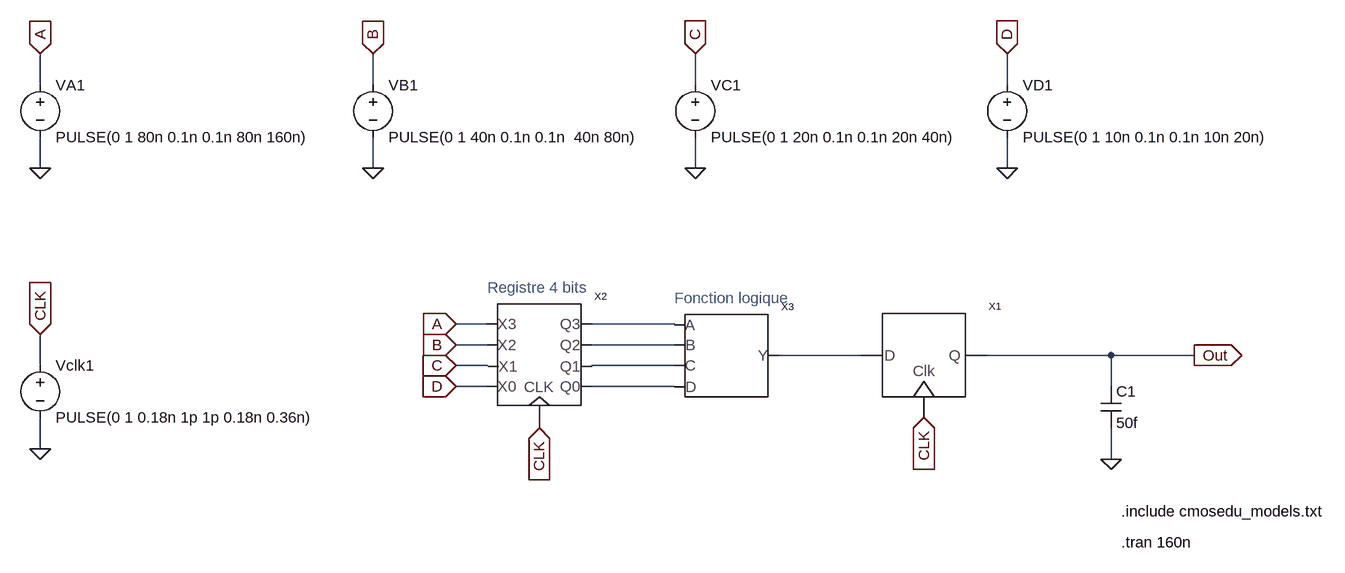
[diagram p0: schematic Draft2.asc]
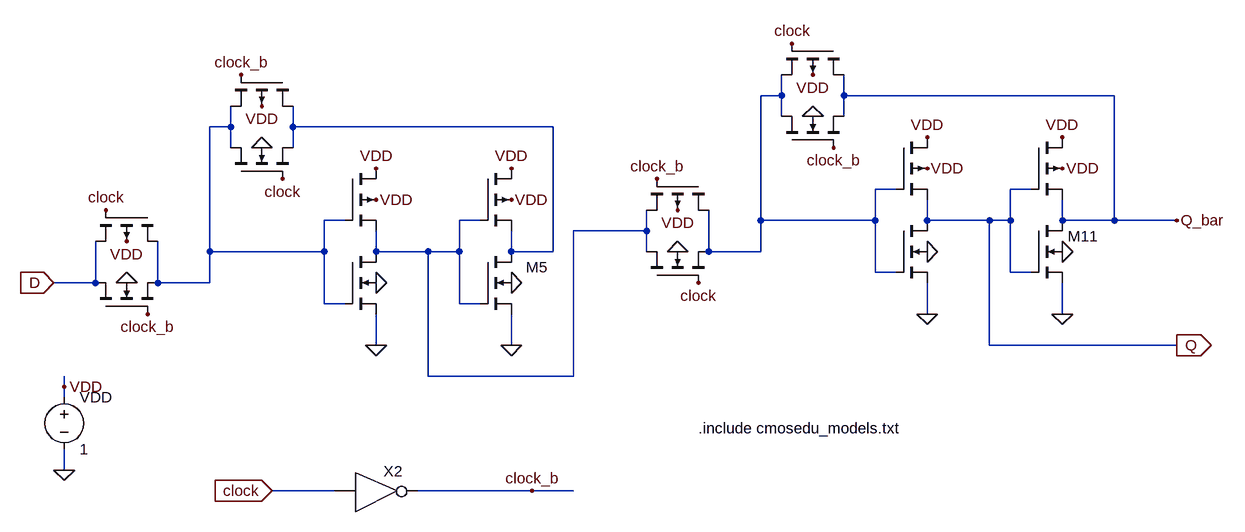
[diagram p1: sub-circuit d_ff.asc]
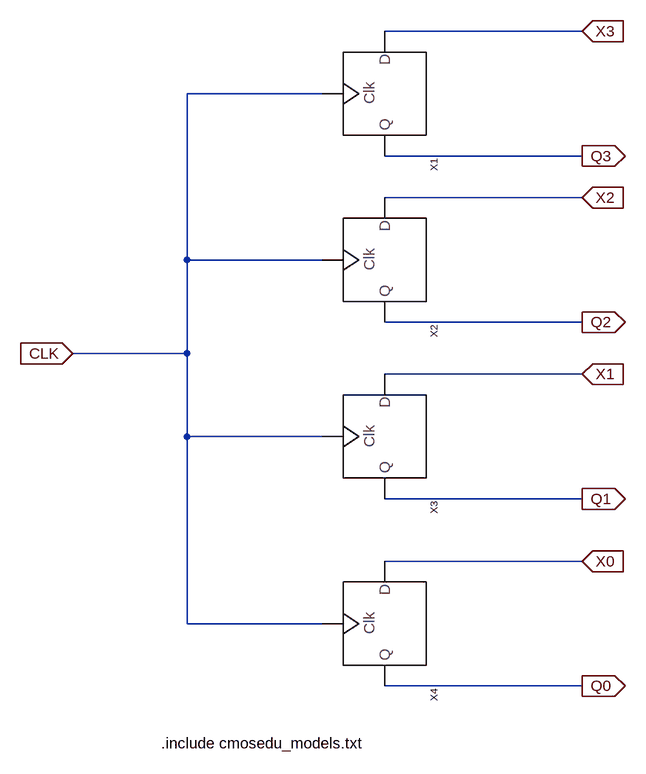
[diagram p2: sub-circuit registre.asc]
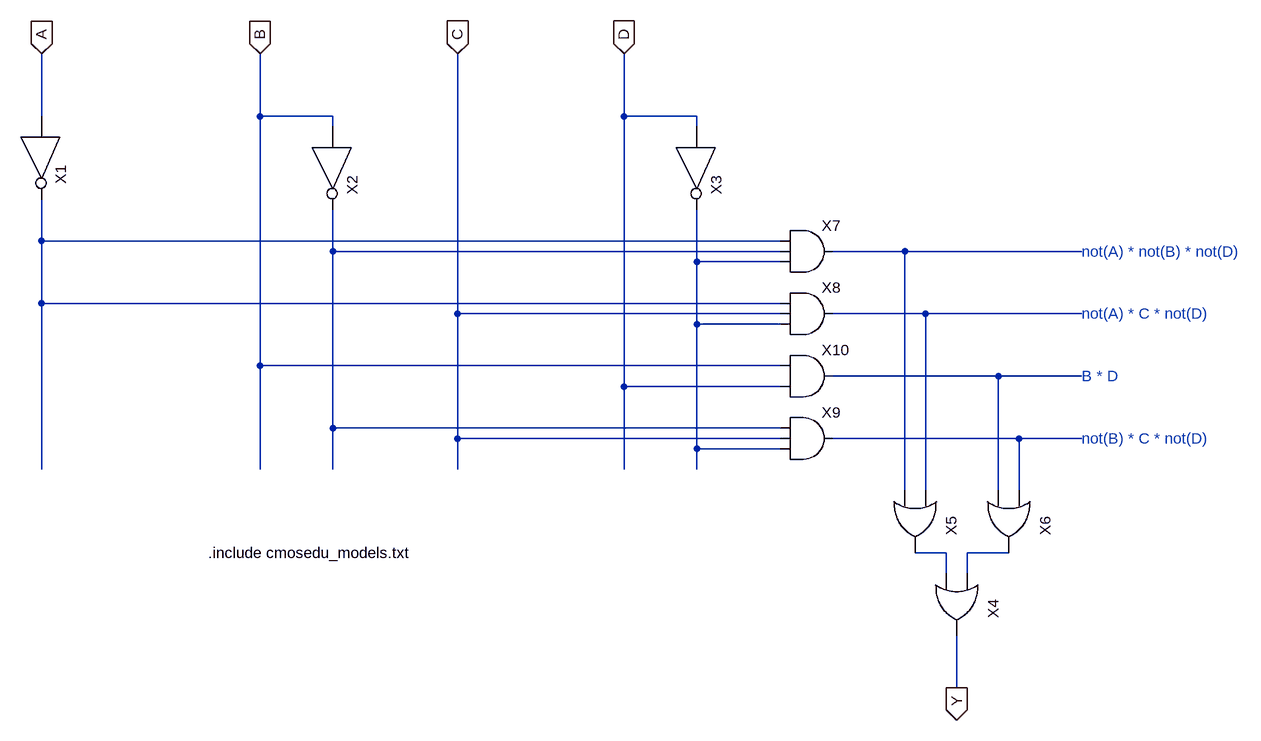
[diagram p3: sub-circuit fonction-logique.asc]
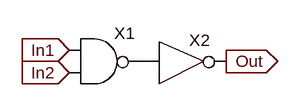
[diagram p4: sub-circuit and2.asc]
Draft2.asc, the LTspice schematic file:
Version 4
SHEET 1 1540 736
WIRE -464 16 -464 -32
WIRE 48 16 48 -32
WIRE 544 16 544 -32
WIRE 1024 16 1024 -32
WIRE -464 144 -464 96
WIRE 48 144 48 96
WIRE 544 144 544 96
WIRE 1024 144 1024 96
WIRE 224 384 176 384
WIRE 512 384 384 384
WIRE 224 416 176 416
WIRE 512 416 384 416
WIRE 800 432 672 432
WIRE 1184 432 992 432
WIRE 1312 432 1184 432
WIRE -464 448 -464 400
WIRE 224 448 176 448
WIRE 512 448 384 448
WIRE 224 480 176 480
WIRE 512 480 384 480
WIRE 1184 480 1184 432
WIRE -464 576 -464 528
WIRE 1184 592 1184 544
FLAG 1184 592 0
FLAG -464 144 0
FLAG 48 144 0
FLAG 544 144 0
FLAG 1024 144 0
FLAG -464 -32 A
IOPIN -464 -32 In
FLAG 48 -32 B
IOPIN 48 -32 In
FLAG 544 -32 C
IOPIN 544 -32 In
FLAG 1024 -32 D
IOPIN 1024 -32 In
FLAG -464 576 0
FLAG -464 400 CLK
IOPIN -464 400 In
FLAG 896 528 CLK
IOPIN 896 528 In
FLAG 304 544 CLK
IOPIN 304 544 In
FLAG 176 384 A
IOPIN 176 384 In
FLAG 176 416 B
IOPIN 176 416 In
FLAG 176 448 C
IOPIN 176 448 In
FLAG 176 480 D
IOPIN 176 480 In
FLAG 1312 432 Out
IOPIN 1312 432 Out
SYMBOL D_FF 896 432 R0
SYMATTR InstName X1
SYMBOL cap 1168 480 R0
SYMATTR InstName C1
SYMATTR Value 50f
SYMBOL voltage -464 0 R0
WINDOW 123 0 0 Left 0
WINDOW 39 0 0 Left 0
SYMATTR InstName VA1
SYMATTR Value PULSE(0 1 80n 0.1n 0.1n 80n 160n)
SYMBOL voltage 48 0 R0
SYMATTR InstName VB1
SYMATTR Value PULSE(0 1 40n 0.1n 0.1n  40n 80n)
SYMBOL voltage 544 0 R0
SYMATTR InstName VC1
SYMATTR Value PULSE(0 1 20n 0.1n 0.1n 20n 40n)
SYMBOL voltage 1024 0 R0
SYMATTR InstName VD1
SYMATTR Value PULSE(0 1 10n 0.1n 0.1n 10n 20n)
SYMBOL voltage -464 432 R0
WINDOW 123 0 0 Left 0
WINDOW 39 0 0 Left 0
SYMATTR InstName Vclk1
SYMATTR Value PULSE(0 1 0.18n 1p 1p 0.18n 0.36n)
SYMBOL registre 304 416 R0
SYMATTR InstName X2
SYMBOL fonction-logique 592 432 R0
SYMATTR InstName X3
TEXT 1200 672 Left 2 !.include cmosedu_models.txt
TEXT 1200 720 Left 2 !.tran 160n
TEXT 512 344 Left 2 ;Fonction logique
TEXT 224 328 Left 2 ;Registre 4 bits

d_ff.asc, the sub-circuit schematic file:
Version 4
SHEET 1 1820 680
WIRE 1120 -688 1120 -720
WIRE 1120 -688 1088 -688
WIRE 1216 -688 1216 -720
WIRE 1632 -688 1216 -688
WIRE 1120 -656 1120 -688
WIRE 1216 -656 1216 -688
WIRE 272 -640 272 -672
WIRE 272 -640 240 -640
WIRE 368 -640 368 -672
WIRE 768 -640 368 -640
WIRE 272 -608 272 -640
WIRE 368 -608 368 -640
WIRE 1296 -544 1264 -544
WIRE 1504 -544 1472 -544
WIRE 448 -496 416 -496
WIRE 656 -496 624 -496
WIRE 1088 -496 1088 -688
WIRE 1264 -496 1264 -544
WIRE 1264 -496 1088 -496
WIRE 1344 -496 1344 -528
WIRE 1440 -496 1344 -496
WIRE 1472 -496 1472 -544
WIRE 1472 -496 1440 -496
WIRE 1552 -496 1552 -528
WIRE 1632 -496 1632 -688
WIRE 1632 -496 1552 -496
WIRE 1728 -496 1632 -496
WIRE 912 -480 912 -512
WIRE 912 -480 800 -480
WIRE 240 -448 240 -640
WIRE 416 -448 416 -496
WIRE 416 -448 240 -448
WIRE 496 -448 496 -480
WIRE 576 -448 496 -448
WIRE 624 -448 624 -496
WIRE 624 -448 576 -448
WIRE 704 -448 704 -480
WIRE 768 -448 768 -640
WIRE 768 -448 704 -448
WIRE 912 -448 912 -480
WIRE 1008 -448 1008 -512
WIRE 1088 -448 1088 -496
WIRE 1088 -448 1008 -448
WIRE 1264 -416 1264 -496
WIRE 1296 -416 1264 -416
WIRE 1472 -416 1472 -496
WIRE 1504 -416 1472 -416
WIRE 64 -400 64 -464
WIRE 64 -400 0 -400
WIRE 160 -400 160 -464
WIRE 240 -400 240 -448
WIRE 240 -400 160 -400
WIRE 416 -368 416 -448
WIRE 448 -368 416 -368
WIRE 624 -368 624 -448
WIRE 656 -368 624 -368
WIRE 1344 -352 1344 -400
WIRE 1552 -352 1552 -400
WIRE 496 -304 496 -352
WIRE 704 -304 704 -352
WIRE 1440 -304 1440 -496
WIRE 1728 -304 1440 -304
WIRE 576 -256 576 -448
WIRE 800 -256 800 -480
WIRE 800 -256 576 -256
WIRE 16 -240 16 -256
WIRE 16 -224 16 -240
WIRE 16 -112 16 -144
WIRE 432 -80 336 -80
WIRE 736 -80 560 -80
WIRE 800 -80 736 -80
FLAG 496 -400 0
FLAG 16 -112 0
FLAG 16 -240 VDD
FLAG 496 -528 VDD
FLAG 496 -304 0
FLAG 496 -576 VDD
FLAG 704 -400 0
FLAG 704 -528 VDD
FLAG 704 -304 0
FLAG 704 -576 VDD
FLAG 112 -400 0
FLAG 144 -352 clock_b
FLAG 112 -464 VDD
FLAG 80 -512 clock
FLAG 320 -608 0
FLAG 352 -560 clock
FLAG 320 -672 VDD
FLAG 288 -720 clock_b
FLAG 1344 -448 0
FLAG 1344 -576 VDD
FLAG 1344 -352 0
FLAG 1344 -624 VDD
FLAG 1552 -448 0
FLAG 1552 -576 VDD
FLAG 1552 -352 0
FLAG 1552 -624 VDD
FLAG 960 -448 0
FLAG 992 -400 clock
FLAG 1728 -496 Q_bar
FLAG 960 -512 VDD
FLAG 928 -560 clock_b
FLAG 1168 -656 0
FLAG 1200 -608 clock_b
FLAG 1168 -720 VDD
FLAG 1136 -768 clock
FLAG 1728 -304 Q
IOPIN 1728 -304 Out
FLAG 0 -400 D
IOPIN 0 -400 In
FLAG 336 -80 clock
IOPIN 336 -80 In
FLAG 736 -80 clock_b
SYMBOL nmos4 448 -448 R0
WINDOW 0 104 24 Invisible 2
WINDOW 3 179 41 Invisible 2
SYMATTR InstName M1
SYMATTR Value N_50n
SYMATTR Value2 l=50n w=500n
SYMBOL voltage 16 -240 R0
WINDOW 123 0 0 Left 2
WINDOW 39 0 0 Left 2
SYMATTR InstName VDD
SYMATTR Value 1
SYMBOL pmos4 448 -576 R0
WINDOW 0 88 9 Invisible 2
WINDOW 3 168 20 Invisible 2
SYMATTR InstName M2
SYMATTR Value P_50n
SYMATTR Value2 l=50n w=1u
SYMBOL nmos4 656 -448 R0
WINDOW 0 104 24 Right 2
WINDOW 3 179 41 Invisible 2
SYMATTR InstName M5
SYMATTR Value N_50n
SYMATTR Value2 l=50n w=500n
SYMBOL pmos4 656 -576 R0
WINDOW 0 88 9 Invisible 2
WINDOW 3 168 20 Invisible 2
SYMATTR InstName M6
SYMATTR Value P_50n
SYMATTR Value2 l=50n w=1u
SYMBOL nmos4 64 -352 R270
WINDOW 0 86 42 Invisible 2
WINDOW 3 82 140 Invisible 2
SYMATTR InstName M7
SYMATTR Value N_50n
SYMATTR Value2 l=50n w=500n
SYMBOL pmos4 160 -512 R90
WINDOW 0 71 26 Invisible 2
WINDOW 3 75 133 Invisible 2
SYMATTR InstName M3
SYMATTR Value P_50n
SYMATTR Value2 l=50n w=1u
SYMBOL nmos4 272 -560 R270
WINDOW 0 86 42 Invisible 2
WINDOW 3 82 140 Invisible 2
SYMATTR InstName M4
SYMATTR Value N_50n
SYMATTR Value2 l=50n w=500n
SYMBOL pmos4 368 -720 R90
WINDOW 0 71 26 Invisible 2
WINDOW 3 75 133 Invisible 2
SYMATTR InstName M8
SYMATTR Value P_50n
SYMATTR Value2 l=50n w=1u
SYMBOL nmos4 1296 -496 R0
WINDOW 0 104 24 Invisible 2
WINDOW 3 179 41 Invisible 2
SYMATTR InstName M9
SYMATTR Value N_50n
SYMATTR Value2 l=50n w=500n
SYMBOL pmos4 1296 -624 R0
WINDOW 0 88 9 Invisible 2
WINDOW 3 168 20 Invisible 2
SYMATTR InstName M10
SYMATTR Value P_50n
SYMATTR Value2 l=50n w=1u
SYMBOL nmos4 1504 -496 R0
WINDOW 0 104 24 Right 2
WINDOW 3 179 41 Invisible 2
SYMATTR InstName M11
SYMATTR Value N_50n
SYMATTR Value2 l=50n w=500n
SYMBOL pmos4 1504 -624 R0
WINDOW 0 88 9 Invisible 2
WINDOW 3 168 20 Invisible 2
SYMATTR InstName M12
SYMATTR Value P_50n
SYMATTR Value2 l=50n w=1u
SYMBOL nmos4 912 -400 R270
WINDOW 0 86 42 Invisible 2
WINDOW 3 82 140 Invisible 2
SYMATTR InstName M13
SYMATTR Value N_50n
SYMATTR Value2 l=50n w=500n
SYMBOL pmos4 1008 -560 R90
WINDOW 0 71 26 Invisible 2
WINDOW 3 75 133 Invisible 2
SYMATTR InstName M14
SYMATTR Value P_50n
SYMATTR Value2 l=50n w=1u
SYMBOL nmos4 1120 -608 R270
WINDOW 0 86 42 Invisible 2
WINDOW 3 82 140 Invisible 2
SYMATTR InstName M15
SYMATTR Value N_50n
SYMATTR Value2 l=50n w=500n
SYMBOL pmos4 1216 -768 R90
WINDOW 0 71 26 Invisible 2
WINDOW 3 75 133 Invisible 2
SYMATTR InstName M16
SYMATTR Value P_50n
SYMATTR Value2 l=50n w=1u
SYMBOL NOT 464 -112 R0
SYMATTR InstName X2
TEXT 992 -176 Left 2 !.include cmosedu_models.txt

registre.asc, the sub-circuit schematic file:
Version 4
SHEET 1 880 1160
WIRE 416 48 112 48
WIRE 16 144 -192 144
WIRE 416 240 112 240
WIRE 416 304 112 304
WIRE -192 400 -192 144
WIRE 16 400 -192 400
WIRE 416 496 112 496
WIRE -192 544 -192 400
WIRE -192 544 -368 544
WIRE 416 576 112 576
WIRE -192 672 -192 544
WIRE 16 672 -192 672
WIRE 416 768 112 768
WIRE 416 864 112 864
WIRE -192 960 -192 672
WIRE 16 960 -192 960
WIRE 416 1056 112 1056
FLAG -368 544 CLK
IOPIN -368 544 In
FLAG 416 48 X3
IOPIN 416 48 In
FLAG 416 304 X2
IOPIN 416 304 In
FLAG 416 576 X1
IOPIN 416 576 In
FLAG 416 864 X0
IOPIN 416 864 In
FLAG 416 240 Q3
IOPIN 416 240 Out
FLAG 416 496 Q2
IOPIN 416 496 Out
FLAG 416 768 Q1
IOPIN 416 768 Out
FLAG 416 1056 Q0
IOPIN 416 1056 Out
SYMBOL D_FF 112 144 R90
SYMATTR InstName X1
SYMBOL D_FF 112 400 R90
SYMATTR InstName X2
SYMBOL D_FF 112 672 R90
SYMATTR InstName X3
SYMBOL D_FF 112 960 R90
SYMATTR InstName X4
TEXT -232 1144 Left 2 !.include cmosedu_models.txt

fonction-logique.asc, the sub-circuit schematic file:
Version 4
SHEET 1 1532 876
WIRE -352 -80 -352 -176
WIRE -16 -80 -16 -176
WIRE 96 -80 -16 -80
WIRE 544 -80 544 -176
WIRE 656 -80 544 -80
WIRE 96 -64 96 -80
WIRE 656 -64 656 -80
WIRE -352 112 -352 48
WIRE 784 112 -352 112
WIRE 96 128 96 64
WIRE 784 128 96 128
WIRE 976 128 864 128
WIRE 1248 128 976 128
WIRE 656 144 656 64
WIRE 784 144 656 144
WIRE -352 208 -352 112
WIRE 784 208 -352 208
WIRE 288 224 288 -176
WIRE 784 224 288 224
WIRE 1008 224 864 224
WIRE 1248 224 1008 224
WIRE 656 240 656 144
WIRE 784 240 656 240
WIRE -16 304 -16 -80
WIRE 784 304 -16 304
WIRE 1120 320 864 320
WIRE 1248 320 1120 320
WIRE 544 336 544 -80
WIRE 784 336 544 336
WIRE 96 400 96 128
WIRE 784 400 96 400
WIRE 288 416 288 224
WIRE 784 416 288 416
WIRE 1152 416 864 416
WIRE 1248 416 1152 416
WIRE 656 432 656 240
WIRE 784 432 656 432
WIRE -352 464 -352 208
WIRE -16 464 -16 304
WIRE 96 464 96 400
WIRE 288 464 288 416
WIRE 544 464 544 336
WIRE 656 464 656 432
WIRE 976 496 976 128
WIRE 1008 496 1008 224
WIRE 1120 496 1120 320
WIRE 1152 496 1152 416
WIRE 1040 592 992 592
WIRE 1136 592 1072 592
WIRE 1040 624 1040 592
WIRE 1072 624 1072 592
WIRE 1056 800 1056 720
FLAG -352 -176 A
IOPIN -352 -176 In
FLAG -16 -176 B
IOPIN -16 -176 In
FLAG 288 -176 C
IOPIN 288 -176 In
FLAG 544 -176 D
IOPIN 544 -176 In
FLAG 1056 800 Y
IOPIN 1056 800 Out
SYMBOL NOT -320 -48 R90
SYMATTR InstName X1
SYMBOL NOT 128 -32 R90
SYMATTR InstName X2
SYMBOL NOT 688 -32 R90
SYMATTR InstName X3
SYMBOL OR2 1120 672 R90
SYMATTR InstName X4
SYMBOL OR2 1056 544 R90
SYMATTR InstName X5
SYMBOL OR2 1200 544 R90
SYMATTR InstName X6
SYMBOL AND3 832 64 R0
SYMATTR InstName X7
SYMBOL AND3 832 160 R0
SYMATTR InstName X8
SYMBOL AND3 832 352 R0
SYMATTR InstName X9
SYMBOL AND2 832 256 R0
SYMATTR InstName X10
TEXT -96 592 Left 2 !.include cmosedu_models.txt
TEXT 1248 128 Left 2 ;not(A) * not(B) * not(D)
TEXT 1248 224 Left 2 ;not(A) * C * not(D)
TEXT 1248 320 Left 2 ;B * D
TEXT 1248 416 Left 2 ;not(B) * C * not(D)

and2.asc, the sub-circuit schematic file:
Version 4
SHEET 1 1136 680
FLAG 592 272 Out
IOPIN 592 272 Out
FLAG 368 256 In1
IOPIN 368 256 In
FLAG 368 288 In2
IOPIN 368 288 In
SYMBOL NAND2 416 208 R0
SYMATTR InstName X1
SYMBOL NOT 496 240 R0
SYMATTR InstName X2

The netlist it stands for:
* Draft2.asc
XX1 N003 Out CLK d_ff
C1 Out 0 50f
VA1 A 0 PULSE(0 1 80n 0.1n 0.1n 80n 160n)
VB1 B 0 PULSE(0 1 40n 0.1n 0.1n  40n 80n)
VC1 C 0 PULSE(0 1 20n 0.1n 0.1n 20n 40n)
VD1 D 0 PULSE(0 1 10n 0.1n 0.1n 10n 20n)
Vclk1 CLK 0 PULSE(0 1 0.18n 1p 1p 0.18n 0.36n)
XX2 D C B A CLK N001 N002 N004 N005 registre
XX3 N001 N002 N004 N005 N003 fonction-logique

* block symbol definitions
.subckt d_ff D Q clock
M1 N004 N002 0 0 N_50n l=50n w=500n
VDD VDD 0 1
M2 VDD N002 N004 VDD P_50n l=50n w=1u
M5 N003 N004 0 0 N_50n l=50n w=500n
M6 VDD N004 N003 VDD P_50n l=50n w=1u
M7 D clock_b N002 0 N_50n l=50n w=500n
M3 N002 clock D VDD P_50n l=50n w=1u
M4 N002 clock N003 0 N_50n l=50n w=500n
M8 N003 clock_b N002 VDD P_50n l=50n w=1u
M9 Q N001 0 0 N_50n l=50n w=500n
M10 VDD N001 Q VDD P_50n l=50n w=1u
M11 Q_bar Q 0 0 N_50n l=50n w=500n
M12 VDD Q Q_bar VDD P_50n l=50n w=1u
M13 N004 clock N001 0 N_50n l=50n w=500n
M14 N001 clock_b N004 VDD P_50n l=50n w=1u
M15 N001 clock_b Q_bar 0 N_50n l=50n w=500n
M16 Q_bar clock N001 VDD P_50n l=50n w=1u
XX2 clock clock_b NOT  ; pins In Out
.include cmosedu_models.txt
.ends d_ff

.subckt registre X0 X1 X2 X3 CLK Q3 Q2 Q1 Q0
XX1 X3 Q3 CLK d_ff
XX2 X2 Q2 CLK d_ff
XX3 X1 Q1 CLK d_ff
XX4 X0 Q0 CLK d_ff
.include cmosedu_models.txt
.ends registre

.subckt fonction-logique A B C D Y
XX1 A N001 NOT  ; pins In Out
XX2 B N002 NOT  ; pins In Out
XX3 D N004 NOT  ; pins In Out
XX4 N009 N008 Y OR2  ; pins In1 In2 Out
XX5 N005 N003 N008 OR2  ; pins In1 In2 Out
XX6 N007 N006 N009 OR2  ; pins In1 In2 Out
XX7 N001 N004 N003 N002 AND3  ; pins In1 In3 Out In2
XX8 N001 N004 N005 C AND3  ; pins In1 In3 Out In2
XX9 N002 N004 N007 C AND3  ; pins In1 In3 Out In2
XX10 B D N006 and2
.include cmosedu_models.txt
* not(A) * not(B) * not(D)
* not(A) * C * not(D)
* B * D
* not(B) * C * not(D)
.ends fonction-logique

.subckt and2 In1 In2 Out
XX1 In1 In2 P001 NAND2  ; pins In1 In2 Out
XX2 P001 Out NOT  ; pins In Out
.ends and2

.model NMOS NMOS
.model PMOS PMOS
.lib standard.mos
.include cmosedu_models.txt
.tran 160n
* Fonction logique
* Registre 4 bits
.backanno
.end